# Altium schematic sheet thermostable_constant_current_source.SchDoc
size A4; Address1: Address1; Address2: Address2; Address3: Address3; Address4: Address4; SheetNumber: 1; Scale: 1:1; Разраб.: Иванов; Обозначение документа: АБВГ.123456.001 Э3; Пров.: Петров; Утв.: Сидоров; Наименование организации: ОАО "Концерн "МПО-Гидроприбор"; Перв. применение: АБВГ.123456.000; Наименование изделия 1: Плата; Наименование изделия 2: Схема электрическая; Наименование изделия 3: принципиальная; Нач. отд.: Нач. отд.; Фамилия нач. отд.: Сидоров
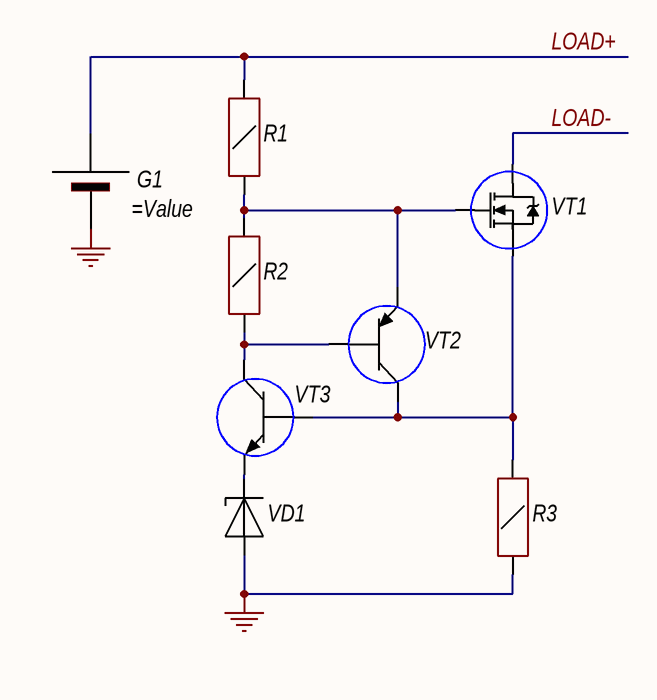
[diagram p0: thermostable_constant_current_source.SchDoc]

## Parts
G1  (no value)  [18650 1PCS]
R1  10к  [CH1206R]  (value not drawn)
R2  10к  [CH1206R]  (value not drawn)
R3  68  [CH1206R]  (value not drawn)
VD1  BZV55C7V5  [SOD80]  (value not drawn)
VT1  *  [DPAK]  (value not drawn)
VT2  BC857  [SOT23_123]  (value not drawn)
VT3  BC847  [SOT23_123]  (value not drawn)

## Nets
GND: G1.2(Negative) R3.1 VD1.1(A)
LOAD+: G1.1(Positive) R1.2
LOAD-: VT1.2(D)
NetR1_1: R1.1 R2.2 VT1.1(G) VT2.2(C)
NetR2_1: R2.1 VT2.1(B) VT3.2(C)
NetR3_2: R3.2 VT1.3(S) VT2.3(E) VT3.1(B)
NetVD1_2: VD1.2(C) VT3.3(E)

## Notes on the sheet
- Title
- Size:
- Date:
- A4
- Number:
- Time:
- Revision:
- Sheet
- of
- File:

## Library data of the parts
G1 = Battery
R1-R3 = Resistor: Manufacturer: *; Model: *; HelpURL: *; ComponentKind: *; Value: *
VD1 = Diod Zener: ComponentKind: *; Manufacturer: *; Model: *; HelpURL: *
VT1 = N-chanel: Mosfet; Model: *; Manufacturer: *; ComponentKind: *; HelpURL: *
VT2 = PNP: Bipolar; Model: *; Manufacturer: *; ComponentKind: *; HelpURL: *
VT3 = NPN: Bipolar; Model: *; Manufacturer: *; ComponentKind: *; HelpURL: *